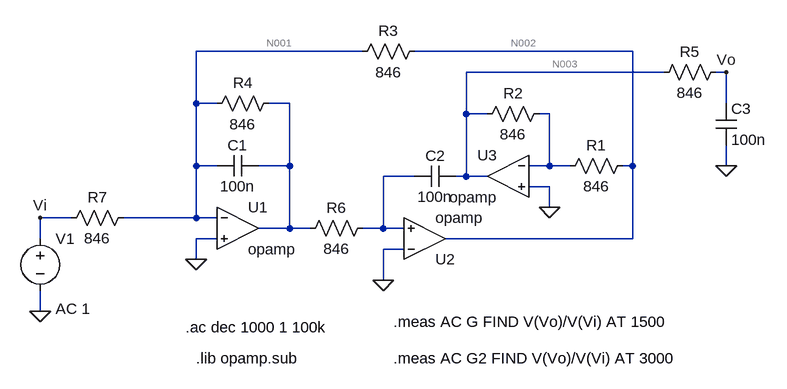
[diagram p0: schematic simulacion2.asc]
simulacion2.asc, the LTspice schematic file:
Version 4
SHEET 1 940 680
WIRE 32 -80 -224 -80
WIRE 448 -80 112 -80
WIRE 496 -48 192 -48
WIRE 592 -48 576 -48
WIRE -224 0 -224 -80
WIRE -192 0 -224 0
WIRE -80 0 -112 0
WIRE 592 0 592 -48
WIRE 192 16 192 -48
WIRE 224 16 192 16
WIRE 320 16 304 16
WIRE -224 96 -224 0
WIRE -192 96 -224 96
WIRE -80 96 -80 0
WIRE -80 96 -128 96
WIRE 320 96 320 16
WIRE 320 96 288 96
WIRE 352 96 320 96
WIRE 448 96 448 -80
WIRE 448 96 432 96
WIRE 592 96 592 64
WIRE 112 112 64 112
WIRE 192 112 192 16
WIRE 192 112 176 112
WIRE 224 112 192 112
WIRE 320 128 288 128
WIRE 320 160 320 128
WIRE -416 176 -464 176
WIRE -224 176 -224 96
WIRE -224 176 -336 176
WIRE -192 176 -224 176
WIRE -80 192 -80 96
WIRE -80 192 -128 192
WIRE -48 192 -80 192
WIRE 64 192 64 112
WIRE 64 192 32 192
WIRE 96 192 64 192
WIRE -464 208 -464 176
WIRE -192 208 -224 208
WIRE 448 208 448 96
WIRE 448 208 160 208
WIRE 96 224 64 224
WIRE -224 240 -224 208
WIRE 64 272 64 224
WIRE -464 320 -464 288
FLAG -464 320 0
FLAG 64 272 0
FLAG 320 160 0
FLAG -224 240 0
FLAG 592 96 0
FLAG 592 -48 Vo
FLAG -464 176 Vi
SYMBOL voltage -464 192 R0
WINDOW 123 24 124 Left 2
WINDOW 39 0 0 Left 0
SYMATTR Value2 AC 1
SYMATTR InstName V1
SYMATTR Value ""
SYMBOL OpAmps\\opamp -160 128 R0
SYMATTR InstName U1
SYMBOL cap -128 80 R90
WINDOW 0 0 32 VBottom 2
WINDOW 3 32 32 VTop 2
SYMATTR InstName C1
SYMATTR Value 100n
SYMBOL OpAmps\\opamp 128 272 M180
SYMATTR InstName U2
SYMBOL cap 176 96 R90
WINDOW 0 0 32 VBottom 2
WINDOW 3 32 32 VTop 2
SYMATTR InstName C2
SYMATTR Value 100n
SYMBOL OpAmps\\opamp 256 48 M0
SYMATTR InstName U3
SYMBOL res 592 -64 R90
WINDOW 0 0 56 VBottom 2
WINDOW 3 32 56 VTop 2
SYMATTR InstName R5
SYMATTR Value 846
SYMBOL cap 576 0 R0
SYMATTR InstName C3
SYMATTR Value 100n
SYMBOL res 448 80 R90
WINDOW 0 0 56 VBottom 2
WINDOW 3 32 56 VTop 2
SYMATTR InstName R1
SYMATTR Value 846
SYMBOL res 320 0 R90
WINDOW 0 0 56 VBottom 2
WINDOW 3 32 56 VTop 2
SYMATTR InstName R2
SYMATTR Value 846
SYMBOL res 128 -96 R90
WINDOW 0 0 56 VBottom 2
WINDOW 3 32 56 VTop 2
SYMATTR InstName R3
SYMATTR Value 846
SYMBOL res -96 -16 R90
WINDOW 0 0 56 VBottom 2
WINDOW 3 32 56 VTop 2
SYMATTR InstName R4
SYMATTR Value 846
SYMBOL res 48 176 R90
WINDOW 0 0 56 VBottom 2
WINDOW 3 32 56 VTop 2
SYMATTR InstName R6
SYMATTR Value 846
SYMBOL res -320 160 R90
WINDOW 0 0 56 VBottom 2
WINDOW 3 32 56 VTop 2
SYMATTR InstName R7
SYMATTR Value 846
TEXT -224 392 Left 2 !.lib opamp.sub
TEXT -240 344 Left 2 !.ac dec 1000 1 100k
TEXT 80 336 Left 2 !.meas AC G FIND V(Vo)/V(Vi) AT 1500
TEXT 80 392 Left 2 !.meas AC G2 FIND V(Vo)/V(Vi) AT 3000

The netlist it stands for:
* simulacion2.asc
V1 Vi 0 AC 1
XU1 N001 0 N004 opamp Aol=100K GBW=10Meg  ; pins invin noninvin out
C1 N004 N001 100n
XU2 0 N006 N002 opamp Aol=100K GBW=10Meg  ; pins invin noninvin out
C2 N003 N006 100n
XU3 N005 0 N003 opamp Aol=100K GBW=10Meg  ; pins invin noninvin out
R5 Vo N003 846
C3 Vo 0 100n
R1 N002 N005 846
R2 N005 N003 846
R3 N002 N001 846
R4 N004 N001 846
R6 N006 N004 846
R7 N001 Vi 846
.lib opamp.sub
.ac dec 1000 1 100k
.meas AC G FIND V(Vo)/V(Vi) AT 1500
.meas AC G2 FIND V(Vo)/V(Vi) AT 3000
.backanno
.end

* Results of the author's LTspice run, read from the files saved beside the schematic
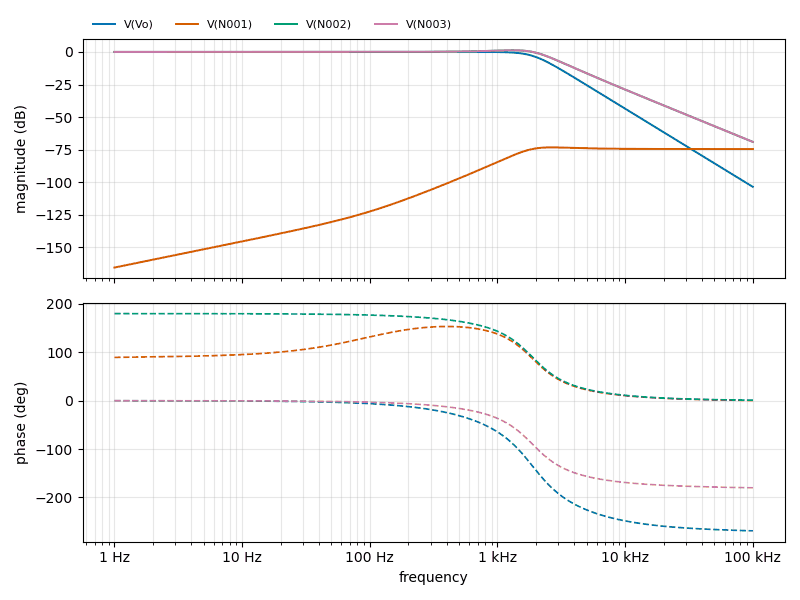
[diagram p1: AC Analysis of simulacion2.asc, plotted from the saved traces]
* AC Analysis, 1 run:
*   V(Vo): -0.00 dB at 1 Hz, -103.54 dB at 100 kHz, peak -0.00 dB at 230.7 Hz, 3 dB below the peak at 1.881 kHz
*   V(N001): -165.47 dB at 1 Hz, -74.51 dB at 100 kHz, peak -73.26 dB at 2.655 kHz, 3 dB below the peak at 1.608 kHz
*   V(N002): -0.00 dB at 1 Hz, -69.02 dB at 100 kHz, peak 1.25 dB at 1.33 kHz, 3 dB below the peak at 2.198 kHz
*   V(N003): -0.00 dB at 1 Hz, -69.02 dB at 100 kHz, peak 1.25 dB at 1.33 kHz, 3 dB below the peak at 2.198 kHz
* From the log:
*   g: v(vo)/v(vi)=(-0.9935dB,-104.056°) at 1500
*   g2: v(vo)/v(vi)=(-12.4217dB,167.981°) at 3000